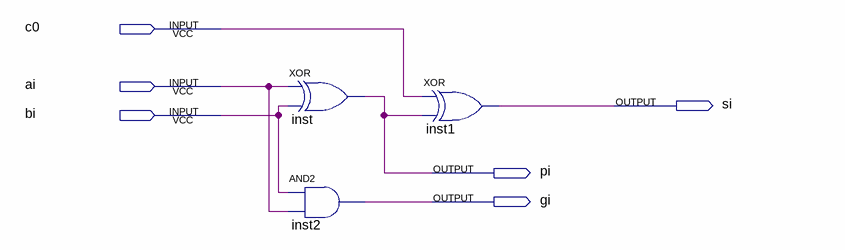
[diagram p0: schematic sheet]
// Quartus schematic SUM.bdf as structural Verilog: 3 symbols, 6 pins
module SUM (
  input  c0,
  input  ai,
  input  bi,
  output si,
  output pi,
  output gi
);

  xor inst (pi, ai, bi);
  and inst2 (gi, bi, ai);
  xor inst1 (si, c0, pi);
endmodule
